# Altium schematic sheet Power_Management.SchDoc
size A3; SheetNumber: 2; SheetTotal: 5
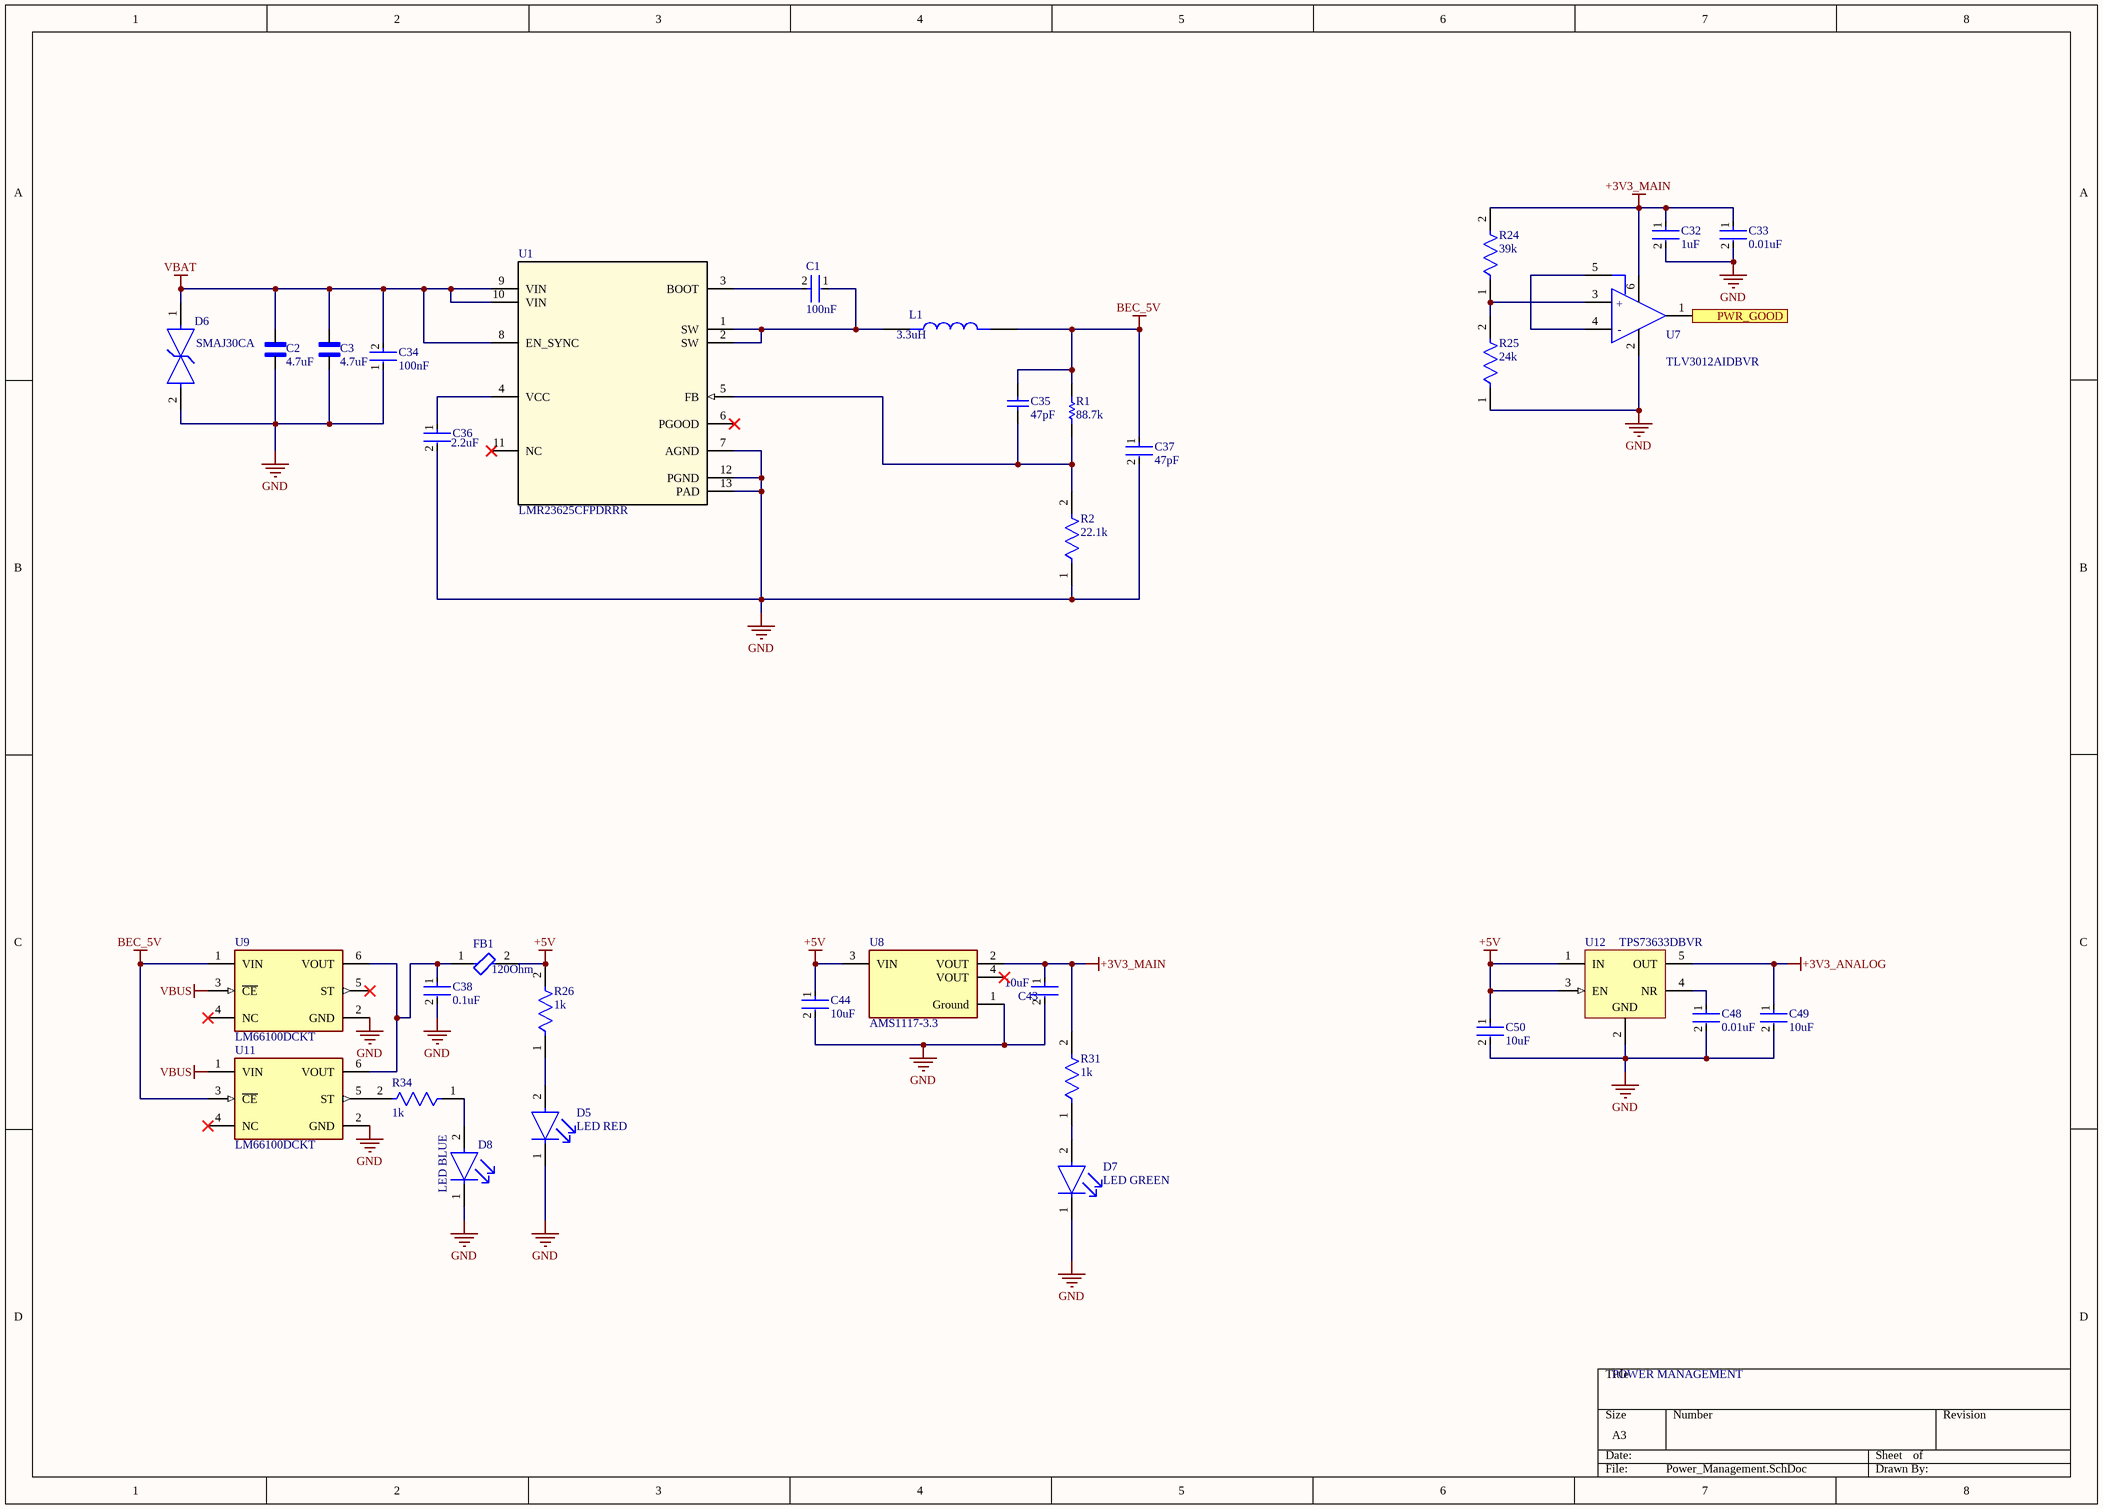
[diagram p0: Power_Management.SchDoc]

## Parts
C1  100nF  [FP-GRM15-MFG]
C2  4.7uF  [CAPC3225X270N]
C3  4.7uF  [CAPC3225X270N]
C32  1uF  [FP-GRM155-0_05-IPC_C]
C33  0.01uF  [FP-GRM022-0_02-IPC_B]
C34  100nF  [FP-C1608-080-0_1-IPC_A]
C35  47pF  [CAPC1005X55X25NL05T10]
C36  2.2uF  [FP-C1005-050-0_05-IPC_A]
C37  47pF  [FP-GRM31C-0_2-e0_3_0_8-IPC_A]
C38  0.1uF  [FP-C0402-BB-MFG]
C43  10uF  [FP-C0402C106M9PACTU-MFG]
C44  10uF  [FP-C0402C106M9PACTU-MFG]
C48  0.01uF  [FP-GRM022-0_02-IPC_B]
C49  10uF  [FP-C0402C106M9PACTU-MFG]
C50  10uF  [FP-C0402C106M9PACTU-MFG]
D5  LED RED  [FP-SML-LXT0805IW-TR-MFG]
D6  SMAJ30CA  [FP-SMAJ-CA-MFG]
D7  LED GREEN  [FP-LTST-C171GKT-MFG]
D8  LED BLUE  [FP-LTST-C191TBKT-MFG]
FB1  120Ohm  [FP-BLM31-0_2-t1_1-MFG]
L1  3.3uH  [IND_XAL4030-332MEB]
R1  88.7k  [RESC1005X40X25NL05T05]
R2  22.1k  [FP-CRCW0402-e3-IPC_A]
R24  39k  [FP-MCS0402-IPC_A]
R25  24k  [FP-CRCW0402-Pe3-IPC_C]
R26  1k  [FP-MCS0402-IPC_A]
R31  1k  [FP-MCS0402-IPC_A]
R34  1k  [FP-MCS0402-IPC_A]
U1  LMR23625CFPDRRR  [DRR0012D]
U7  TLV3012AIDBVR  [FP-DBV0006A-IPC_B]
U8  AMS1117-3.3  [FP-AMS1117-IPC_C]
U9  LM66100DCKT  [FP-DCK0006A-MFG]
U11  LM66100DCKT  [FP-DCK0006A-MFG]
U12  TPS73633DBVR  [DBV0005A_L]

## Ports
PWR_GOOD (out, see EMP_FC_Main[2C], MCU_Core[3B])

## Nets
+3V3_ANALOG: C49.1 U12.5(OUT)
+3V3_MAIN: C32.1 C33.1 C43.1 R24.2 R31.2 U7.6(V+) U8.2(VOUT)
+5V: C44.1 C50.1 FB1.2 R26.2 U8.3(VIN) U12.1(IN) U12.3(EN)
BEC_5V: C35.2 C37.1 L1.2 R1.2 U9.1(VIN) U11.3(~{CE})
GND: C2.1 C3.1 C32.2 C33.2 C34.1 C36.2 C37.2 C38.2 C43.2 C44.2 C48.2 C49.2 C50.2 D5.1(C) D6.2 D7.1(C) D8.1(C) R2.1 R25.1 U1.7(AGND) U1.12(PGND) U1.13(PAD) U7.2(V-) U8.1(Ground) U9.2(GND) U11.2(GND) U12.2(GND)
VBAT: C2.2 C3.2 C34.2 D6.1 U1.8(EN_SYNC) U1.9(VIN) U1.10(VIN)
VBUS: U9.3(~{CE}) U11.1(VIN)
PWR_GOOD: U7.1(OUT) ; port PWR_GOOD
NetC1_1: C1.1 L1.1 U1.1(SW) U1.2(SW)
NetC1_2: C1.2 U1.3(BOOT)
NetC35_1: C35.1 R1.1 R2.2 U1.5(FB)
NetC36_1: C36.1 U1.4(VCC)
NetC38_1: C38.1 FB1.1 U9.6(VOUT) U11.6(VOUT)
NetC48_1: C48.1 U12.4(NR)
NetD5_2: D5.2(A) R26.1
NetD7_2: D7.2(A) R31.1
NetD8_2: D8.2(A) R34.1
NetR24_1: R24.1 R25.2 U7.3(IN+)
NetR34_2: R34.2 U11.5(ST)
NetU7_4: U7.4(IN-) U7.5(REF)

Not connected (* = marked no-connect by the designer): U1 6(PGOOD)* 11(NC)*; U8 4(VOUT)*; U9 4(NC)* 5(ST)*; U11 4(NC)*

## Notes on the sheet
- POWER MANAGEMENT
- (in symbol CMP-04896-000075-1) +

## Library data of the parts
C1 = CMP-2100-03641-2: CAP CER 0.1UF 16V X7R 0402; Manufacturer Part Number: GRM155R71C104KA88D; Manufacturer: Murata; Standoff Height: 0mm; Tolerance: 10%; Voltage Rating: 16Vdc; Material: Ceramic; Capacitance: 0.10μF; Value: 0.10μF; RoHS: TRUE; Temperature Characteristic: X7R; Octopart: https://octopart.com/grm155r71c104ka88d-murata-196880; Digikey Description: CAP CER 0.1UF 16V X7R 0402; Device Class L3: Ceramic Capacitors; Height: 0.55mm; ComponentLink2Description: Datasheet; Temperature Range Low: -55°C; Ipc Land Pattern Name: CAPC10050X219; ComponentLink2URL: https://search.murata.co.jp/Ceramy/image/img/A01X/G101/ENG/GRM155R71H471KA01-01A.pdf; Device Class L1: Passive Components; Lead Free: yes; Category: Cap; Package: GRM15; Temperature: -55°C to +125°C; Device Class L2: Capacitors; Temperature Range High: +125°C; Mouser Description: 0402 0.1 uF 16V ±10 % Tolerance X7R SMT Multilayer Ceramic Capacitor
C2 C3 = MSASU32MSB7475MPNA01: MF: {'manufacturer': u'Taiyo Yuden'}; Package: None; Price: None; Value: *; MP: MSASU32MSB7475MPNA01; Availability: Unavailable
C32 = CMP-06035-057649-1: Chip Multilayer Ceramic Capacitors for General Purpose, 0402, 1.0uF, B, 10%, 10%, 25V; Capacitance: 1uF; Length: 1mm; Width: 500um; Thickness: 500um; Voltage Rating (DC): 25V; Tolerance: 10%
C33 C48 = CMP-06035-063197-1: Chip Multilayer Ceramic Capacitors for General Purpose, 10000pF ±20%, X6S(EIA), ±22.0%, 4Vdc, 01005 (0402M)
C34 = CMP-08246-002700-1: Multilayer Ceramic Capacitors 100nF ±10% 100V X7S SMD 0603; Depth: 0.8mm; Resistor Type: Ceramic; Lead Free: Lead Free; Case Code (Metric): 1608; Width: 0.031inch; Case Code (Imperial): 0603; Tolerance: 10%; Case/Package: 0603; RoHS Compliant: Yes; Max Operating Temperature: 125°C; Voltage Rating: 100V; Series: C; Length: 1.6mm; Mount: Surface Mount; Min Operating Temperature: -55°C; Weight: 7.1E-05oz; Package Quantity: 4000; Number of Pins: 2; Packaging: Tape and Reel; Thickness: 0.037inch; Termination: SMD/SMT; Dielectric: X7S; Height: 0.8mm; Capacitance: 100nF; REACH SVHC: No SVHC; Voltage Rating (DC): 100V
C35 = CMP-2008-04203-1: Part Number: GRM1555C1E470JA01D; Manufacturer: Murata
C36 = CMP-2000-05998-2: Multilayer Ceramic Capacitors 2.2μF ±10% 16V X5R SMD 0402; REACH SVHC: No SVHC; Series: C; Termination: SMD/SMT; Case Code (Imperial): 0402; Depth: 0.5mm; Mount: Surface Mount; Width: 0.02inch; Package Quantity: 1; Dielectric Material: Ceramic; Length: 1mm; Packaging: Tape and Reel; Case Code (Metric): 1005; RoHS Compliant: Yes; Dielectric: X5R; Max Operating Temperature: 85°C; Lead Free: Lead Free; Weight: 2.3E-05oz; Thickness: 0.022inch; Capacitance: 2.2uF; Voltage Rating (DC): 16V; Tolerance: 10%; Voltage Rating: 16V; Resistor Type: Ceramic; Height: 0.5mm; Case/Package: 0402; Min Operating Temperature: -55°C
C37 = CMP-06035-007919-1: Chip Multilayer Ceramic Capacitors for General Purpose, 1206, 47uF, X5R, 15%, 10%, 10V; Width: 0.063inch; Thickness: 0.071inch; Max Operating Temperature: 85°C; Min Operating Temperature: -55°C; Length: 3.2mm; Case Code (Metric): 3216; Resistor Type: Ceramic; Packaging: Tape and Reel; Weight: 0.001411oz; Case Code (Imperial): 1206; Mount: Surface Mount; Depth: 1.6mm; Capacitance: 47uF; Package Quantity: 6000; Height: 1.6mm; Case/Package: 1206; Tolerance: 10%; Dielectric: X5R; Voltage Rating: 10V; Voltage Rating (DC): 10V; Termination: SMD/SMT
C38 = CMP-1034-02066-3: CAP CER 0.1UF 10V 20% X7R 0402; Manufacturer Part Number: C0402C104M8RACTU; Manufacturer: Kemet; Tolerance: 0.2; Capacitance: 0.10 μF; Value: 0.10 μF; Material: Ceramic; Temperature Coefficient: 15%; Temperature Range Low: -55°C; Device Class L3: Ceramic Capacitors; RoHS: TRUE; Automotive: No; Device Class L2: Capacitors; Temperature Characteristic: X7R; Octopart: https://octopart.com/c0402c104m8ractu-kemet-9144037; Digikey Description: CAP CER 0.1UF 10V 20% X7R 0402; Mouser Description: Multilayer Ceramic Capacitors MLCC - SMD/SMT 10volts 0.1uF X7R 20%; Ipc Land Pattern Name: CAPC10050X50; Voltage Rating: 10 V; Lead Free: Yes; Device Class L1: Passive Components; ComponentLink2URL: https://content.kemet.com/datasheets/KEM_C1002_X7R_SMD.pdf; Category: Cap; ComponentLink2Description: Datasheet; Temperature Range High: +125°C; Height: 0.55mm; Temperature: -55°C to +125°C; Package: C0402-BB
C43 C44 C49 C50 = CMP-03020-034678-1: CAP CER 10UF 6.3V X5R 0402; Tolerance: 20%; Dielectric Material: Ceramic; Voltage Rating: 6.3V; Thickness: 0.028inch; REACH SVHC: No SVHC; RoHS Compliant: Yes; Case Code (Metric): 1005; Lead Free: Lead Free; Length: 0.039inch; Max Operating Temperature: 85°C; Capacitance: 10uF; Voltage Rating (DC): 6.3V; Min Operating Temperature: -55°C; Case/Package: 0402; Mount: Surface Mount; Case Code (Imperial): 0402; Dielectric: X5R; Packaging: Cut Tape; Width: 0.02inch
D5 = CMP-1724-00002-2: LED RED DIFFUSED SMD; Lens Style: Rectangular; Luminous Intensity: 11mcd; Approvals: UL; Test Current: 20mA; Forward Voltage: 2V; Number of LEDs: 1; Wavelength: 635nm; Lens Color: White; Viewing Angle: 140°; Min Operating Temperature: -25°C; Case Code (Metric): 2012; Mount: Surface Mount; Case Code (Imperial): 0805; Height: 0.8mm; Lead Free: Lead Free; Color: Red; Package Quantity: 1; Illumination Color: Red; Lens Transparency: Diffused; Forward Current: 20mA; Packaging: Tape and Reel; Length: 2mm; Case/Package: 0805; REACH SVHC: No SVHC; Width: 1.25mm; Number of Pins: 2; Max Operating Temperature: 80°C; Dominant Wavelength: 635nm
D6 = CMP-2000-07088-2: TVS DIODE 30V 48.4V DO214AC; Breakdown Voltage: 33.3V; Peak Pulse Current: 8.3A; Polarity: Bidirectional; Max Breakdown Voltage: 36.8V; Leakage Current: 1uA; Power Dissipation: 400W; Number of Bidirectional Channels: 1; Element Configuration: Single; Test Current: 1mA; Power Line Protection: No; Max Power Dissipation: 3.3W; Length: 4.5mm; Max Surge Current: 8.3A; Voltage Rating (DC): 30V; Package Quantity: 5000; Composition: Zener; Number of Pins: 2; Clamping Voltage: 48.4V; Termination: SMD/SMT; Width: 2.79mm; Lead Free: Lead Free; Height: 2.087mm; Mount: Surface Mount; REACH SVHC: No SVHC; Number of Channels: 1; Min Operating Temperature: -65°C; Max Reverse Leakage Current: 1uA; Number of Elements: 1; Max Operating Temperature: 150°C; Packaging: Tape and Reel; Peak Pulse Power: 400W; Reverse Breakdown Voltage: 33.3V; Direction: Bidirectional; Min Breakdown Voltage: 33.3V; Reverse Standoff Voltage: 30V; Operating Supply Voltage: 30V; Radiation Hardening: No
D7 = CMP-22017-000007-1: LED GREEN CLEAR CHIP SMD; Luminous Intensity: 12mcd; Lens Color: Colorless; Dominant Wavelength: 569nm; Number of LEDs: 1; Power Dissipation: 100mW; Viewing Angle: 130°; Reverse Voltage: 5V; Test Current: 10mA; Forward Voltage: 2.1V; Wavelength: 585nm; Lens Style: Diffused; Forward Current: 30mA; Height: 0.8mm; Mount: Surface Mount; Package Quantity: 1; Length: 2mm; Case Code (Metric): 2012; Number of Pins: 2; Number of Elements: 1; Packaging: Tape and Reel; Color: Green; Min Operating Temperature: -55°C; Case/Package: 0805; Power Rating: 100mW; Max Operating Temperature: 85°C; Radiation Hardening: No; Depth: 1.25mm; Lens Transparency: Clear; Width: 1.25mm; Lead Free: Lead Free; Case Code (Imperial): 0805; Illumination Color: Green
D8 = CMP-22017-000008-1: LED BLUE CLEAR CHIP SMD; Lens Color: Colorless; Dominant Wavelength: 475nm; Forward Current: 20mA; Wavelength: 468nm; Viewing Angle: 130°; Power Dissipation: 76mW; Luminous Intensity: 180mcd; Reverse Voltage: 5V; Number of Elements: 1; Lens Style: Diffused; Forward Voltage: 3.8V; Max Power Dissipation: 75mW; Case Code (Metric): 1608; Packaging: Tape and Reel; Case/Package: 0603; Depth: 1.6mm; Mount: Surface Mount; Lead Free: Lead Free; Min Operating Temperature: -20°C; Lens Transparency: Clear; Illumination Color: Blue; Height: 0.55mm; Test Current: 20mA; Case Code (Imperial): 0603; Max Operating Temperature: 80°C; Number of Pins: 2; Length: 0.8mm; Radiation Hardening: No; Package Quantity: 1; Number of LEDs: 1; Width: 0.8mm; Color: Blue
FB1 = CMP-0686-00732-3: Chip Ferrite Bead Array, 1206, 120Ω @ 100MHz, 0.02Ω, 25%, 3.5A; Number of Lines: 1; DC Current: 3A; Impedance: 120R; Material: Steel; DC Resistance (DCR): 20mR; Shielding: Unshielded; Number of Pins: 2; Case Code (Metric): 3216; Contact Plating: Tin; Radiation Hardening: No; Termination: SMD/SMT; Lead Free: Lead Free; Core Material: Ferrite; Case Code (Imperial): 1206; Test Frequency: 100MHz; Depth: 1.6mm; Max Operating Temperature: 125°C; Package Quantity: 3000; Packaging: Tape and Reel; Min Operating Temperature: -55°C; Length: 3.2mm; Current Rating: 3.5A; RoHS Compliant: Yes; Tolerance: 25%; Width: 1.6mm; Max Current Rating: 3.5A; Frequency: 100MHz; Military Standard: Not; Case/Package: 1206; Max DC Current: 3A; Height: 1.1mm
L1 = XAL4030-332MEB: Package: None; Price: None; Value: *; MP: XAL4030-332MEB; Availability: Unavailable
R1 = CMP-2002-00251-1: Manufacturer: Vishay Dale; Part Number: CRCW040288K7FKED
R2 = CMP-2002-08380-2: RES Thick Film, 22.1kΩ, 1%, 0.063W, 100ppm/°C, 0402; Voltage Rating: 50V; Resistance: 22.1kR; Power Rating: 63mW; Length: 1mm; Termination: SMD/SMT; Height: 0.35mm; Package Quantity: 10000; Depth: 0.5mm; Lead Free: Lead Free; Packaging: Tape and Reel; Case/Package: 0402; Max Operating Temperature: 155°C; Composition: Thick Film; Min Operating Temperature: -55°C; Working Voltage: 50V; Number of Pins: 2; Contact Plating: Tin; Mount: Surface Mount; Case Code (Imperial): 0402; Temperature Coefficient: 100ppm/°C; Tolerance: 1%; Voltage Rating (DC): 50V; Width: 0.5mm; Number of Terminations: 2; Radiation Hardening: No; Weight: 2.3E-05oz; Military Standard: Not; Case Code (Metric): 1005
R24 = CMP-2002-02506-2: RES SMD 1.2K OHM 1% 1/10W 0402; Tolerance: 0.1%; Max Power Dissipation: 63mW; Resistance: 39kR; Temperature Coefficient: 25ppm/°C; Case/Package: 0402; Number of Terminations: 2; Composition: Thin Film; Max Operating Temperature: 125°C; Packaging: Tape and Reel; Height: 0.015inch; Length: 0.039inch; Lead Free: Lead Free; Min Operating Temperature: -55°C; Package Quantity: 1000; Width: 0.02inch
R25 = CMP-03613-000042-1: RES Thick Film, 24kΩ, 1%, 0.063W, 50ppm/°C, 0402; Max Power Dissipation: 63mW; Resistance: 24kR; Width: 0.02inch; Series: CRCW-P; Length: 0.039inch; Tolerance: 1%; Height: 0.016inch; Packaging: Tape and Reel; Resistor Type: Thick Film; Number of Terminations: 2; Package Quantity: 10000; RoHS Compliant: Yes; Max Operating Temperature: 155°C; Min Operating Temperature: -55°C; Case/Package: 0402; Features: Automotive AEC-Q200; Temperature Coefficient: 50ppm/°C
R26 R31 R34 = CMP-02407-001712-1: RES SMD 1.2K OHM 1% 1/10W 0402; Tolerance: 0.5%; Temperature Coefficient: 25ppm/°C; Max Power Dissipation: 200mW; Resistance: 1kR; Case Code (Metric): 1005; Min Operating Temperature: -55°C; Max Operating Temperature: 175°C; Features: Automotive AEC-Q200; Composition: Thin Film; Case Code (Imperial): 0402; Number of Terminations: 2; Case/Package: 0402; Packaging: Cut Tape
U1 = LMR23625CFPDRRR: SIMPLE SWITCHERÂ®, 36V 2.5A Synchronous Step-Down Converter 12-WSON -40 to 125; Manufacturer_Name: Texas Instruments; TYPE: TYPE; RefDes: RefDes; Copyright: Copyright (C) 2025 Ultra Librarian. All rights reserved.; Manufacturer_Part_Number: LMR23625CFPDRRR; Datasheet: https://www.ti.com/lit/gpn/lmr23625
U7 = CMP-04896-000075-1: IC COMPARATOR 1.8V W/REF SOT23-6; Max Supply Current: 5uA; Max Input Current: 10pA; Number of Elements: 1; Response Time: 6us; Propagation Delay: 13.5us; Max Supply Voltage: 5.5V; Input Offset Voltage (Vos): 12mV; Output Current: 500uA; Power Supply Rejection Ratio (PSRR): 80dB; Common Mode Rejection Ratio: 74dB; Output Type: PUSH-PULL; Max Operating Temperature: 85°C; REACH SVHC: No SVHC; Mount: Surface Mount; Case/Package: SOT-23-6; Min Operating Temperature: -40°C; Min Supply Voltage: 1.8V; Number of Channels: 1; Series: -; Packaging: Tape and Reel; Input Bias Current: 10pA; Lead Free: Lead Free; Number of Pins: 6; Package Quantity: 3000; Nominal Supply Current: 5uA; Radiation Hardening: No; RoHS Compliant: Yes; Contact Plating: Gold; Supply Current: 5uA; Quiescent Current: 5uA
U8 = CMP-209535-000001-1: LDO Voltage Regulators 1A, 3.3V; Manufacturer: Advanced Monolithic Systems; Dropout Voltage: 1.1V; Output Type: Fixed; Nominal Supply Current: 5mA; Max Power Dissipation: 1.2W; Max Supply Voltage: 15V; Number Of Outputs: 1; Standoff Height: 0.64mm; Max Junction Temp: +125°C; Height: 1.8mm; Package: AMS1117; Device Class L2: Power Management ICs; ComponentLink2Description: Datasheet; ComponentLink2URL: http://www.advanced-monolithic.com/pdf/ds1117.pdf; Category: IC; RoHS: TRUE; Automotive: No; Device Class L1: Integrated Circuits (ICs); Output Current: 1A; Device Class L3: Voltage Regulators - Linear; Temperature: -40°C to +125°C; Output Voltage: 3.3V; Manufacturer Part Number: AMS1117-3.3; Temperature Range Low: -40°C; Octopart: https://octopart.com/ams1117-3.3-advanced+monolithic+systems-25899300; Lead Free: Yes; Ipc Land Pattern Name: SOT229P700X180-4; Temperature Range High: +125°C
U9 U11 = CMP-04910-000059-1: IC OR CTRLR IDEAL DIODE SC70-6
U12 = CMP-0395-00256-2: Single Output Low Noise LDO, 400 mA, Fixed 3.3 V Output, 1.7 to 5.5 V Input, with Reverse Current Protection, 5-pin SOT-23 (DBV), -40 to 85 degC, Green (RoHS & no Sb/Br); Manufacturer: Texas Instruments; Vin(Min)(V): 1.7; Vdo(Typ)(mV): 75; Iq(Typ)(mA): 0.3; SubFamily: Single Channel LDO; Vout Adj(Max)(V): 3.3; Accuracy(%): 1; Vin(Max)(V): 5.5; Iout(Max)(A): 0.4; Rating: Catalog; ComponentLink1Description: Manufacturer URL; PartNumber: TPS73633DBVR; PackageDescription: 5-Pin Plastic Small Outline, Body 1.60 Ãƒâ€” 2.90 mm, Pitch 0.95 mm; ComponentLink3URL: http://www.ti.com/litv/pdf/mpds018i; ComponentLink2Description: Datasheet; ComponentLink4Description: URL Link1; DatasheetVersion: SBVS038T; Vout Adj(Min)(V): 3.3; Code_JEDEC: MO-178; Fixed Output Options(V): 3.3; Eco-Plan: Green (RoHS & no Sb/Br); PackageReference: DBV0005A; ComponentLink4URL: Samples URL:http://www.ti.com/product/tps73633#samples; PackageVersion: 4073253-4/K; ComponentLink2URL: http://www.ti.com/general/docs/lit/getliterature.tsp?genericPartNumber=TPS73633&fileType=pdf; ComponentLink1URL: http://www.ti.com/; ComponentLink3Description: Package Specification; Mounting Technology: Surface Mount